# EasyEDA Pro project LisaFPGA Rev 2 EasyEDA Project.epro, schematic LisaFPGA Schematic, sheets 4 to 5 of 8

## Sheets
4 Floppy Interface: Create Date: 2025-10-27; Page Name: Floppy Interface; Update Date: 2026-01-15
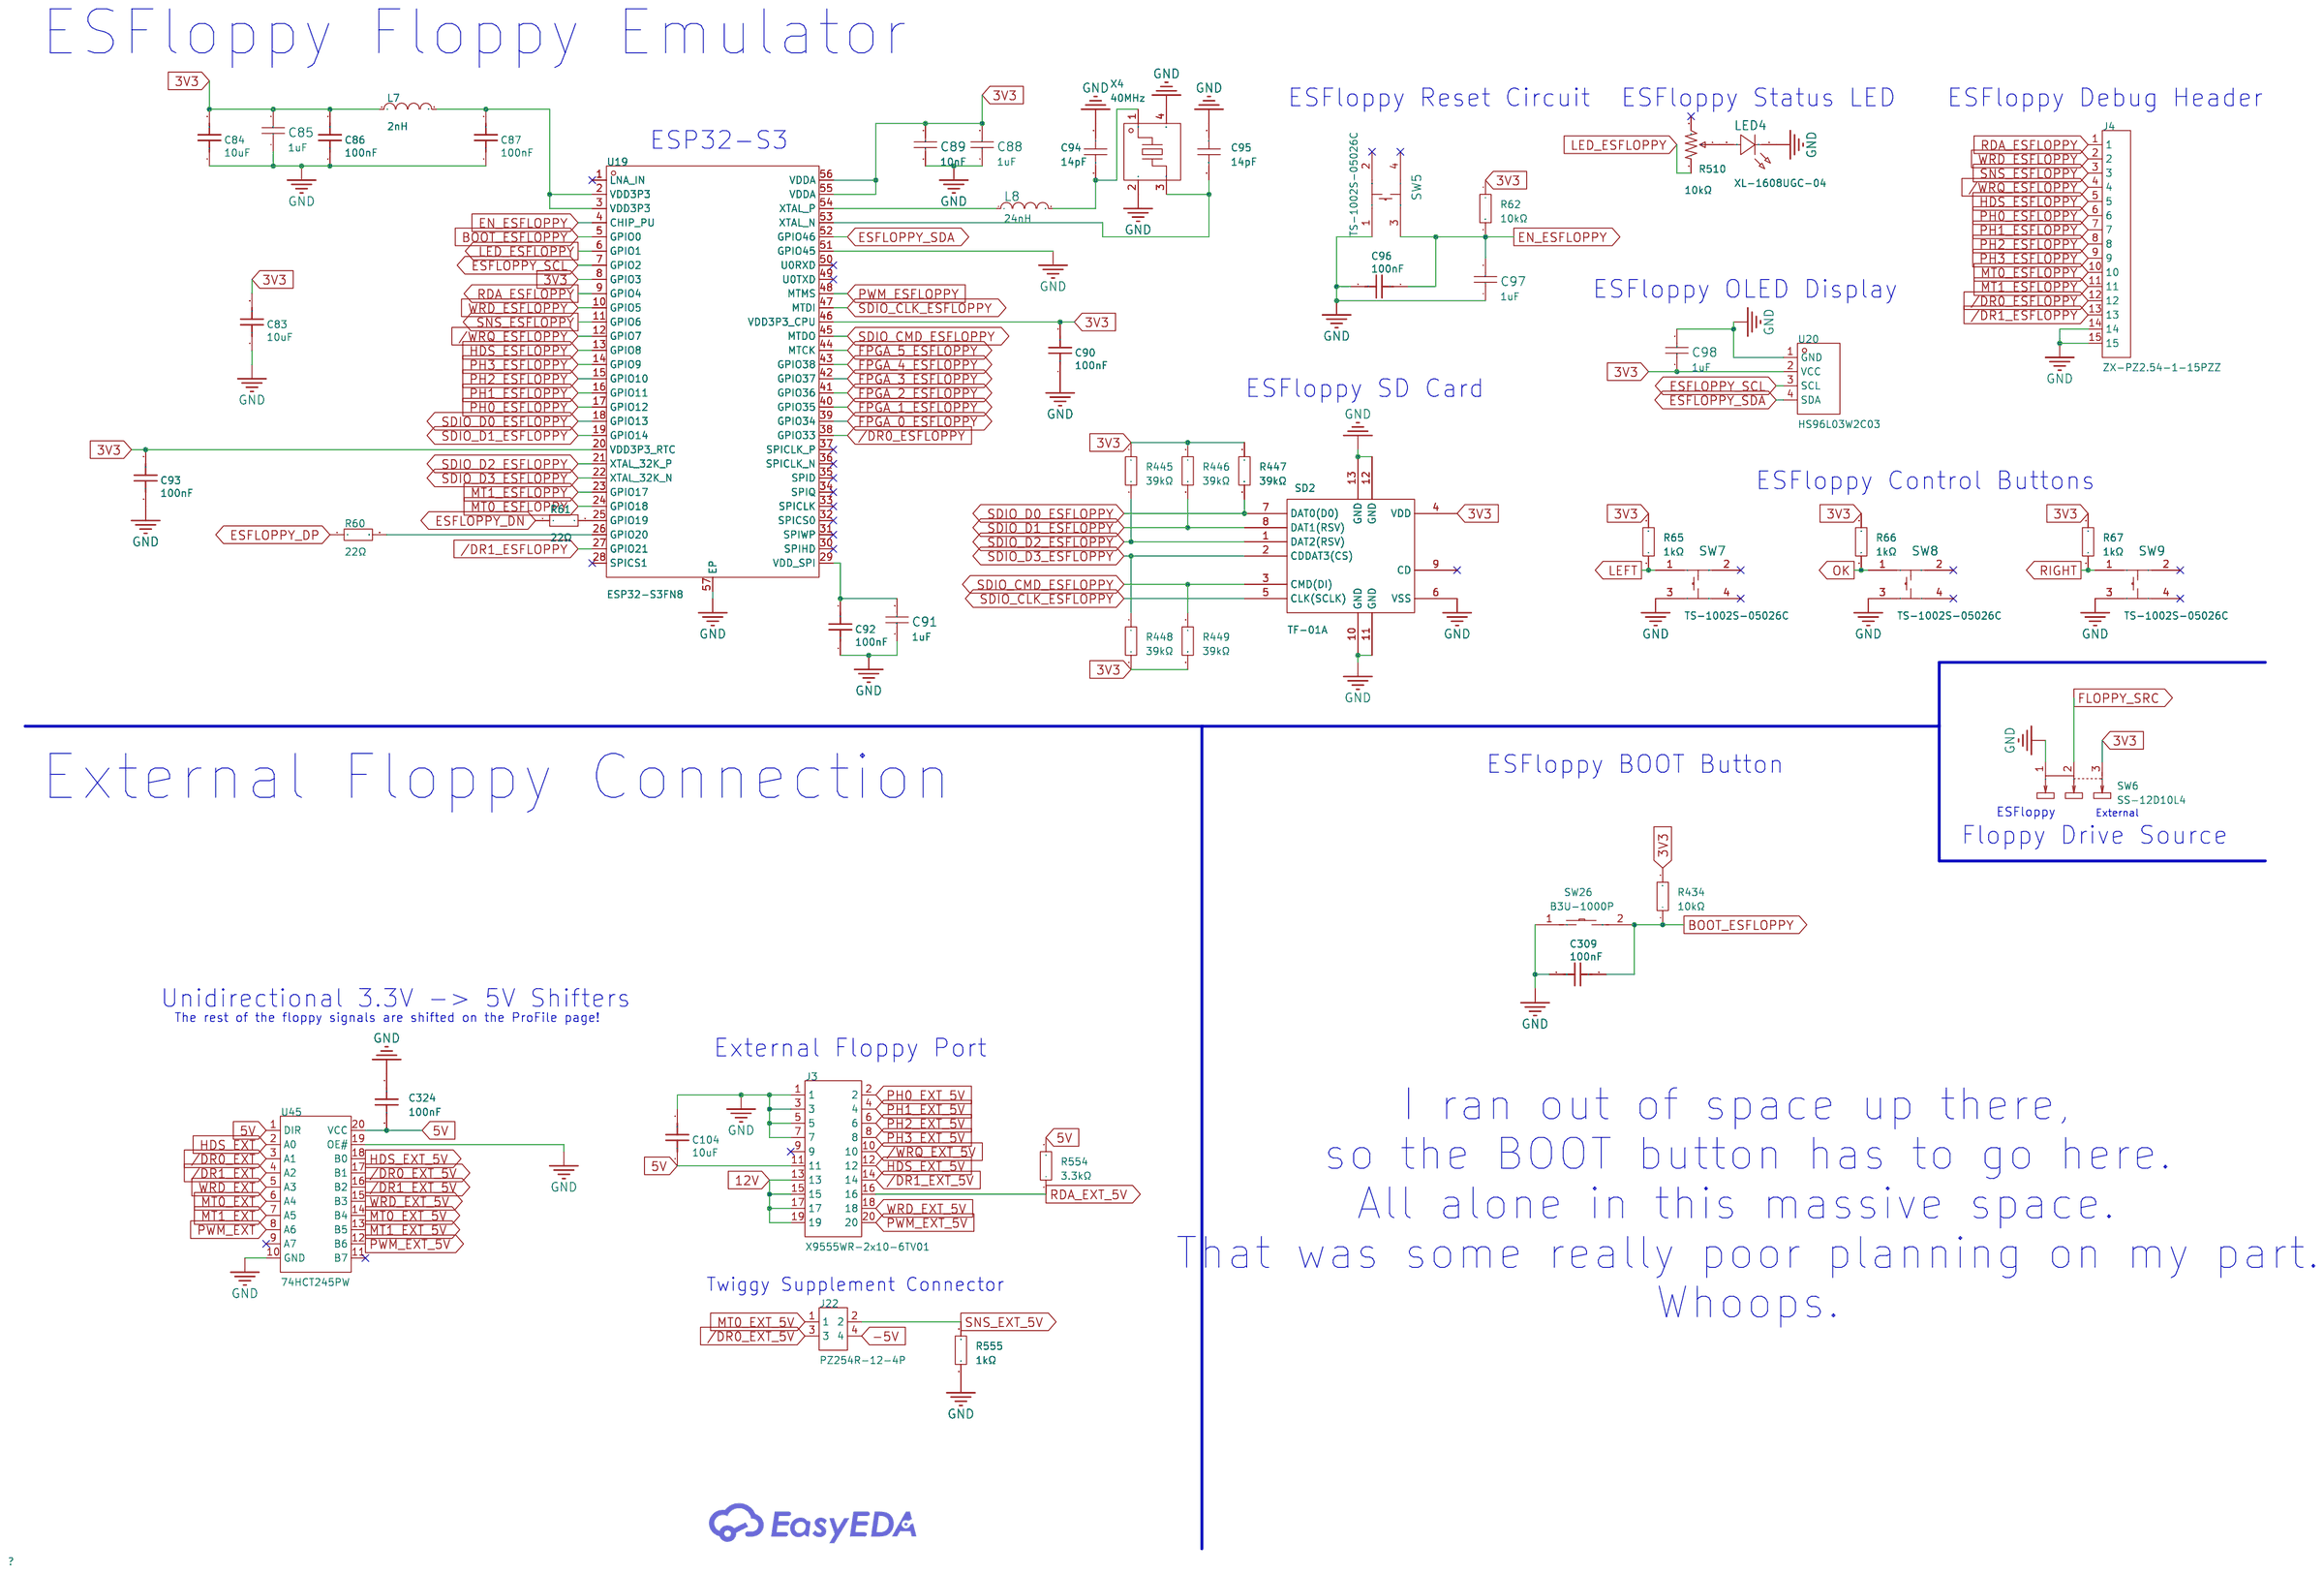
[diagram p4: Floppy Interface]
5 Serial Ports: Create Date: 2025-10-28; Page Name: Serial Ports; Update Date: 2026-01-13
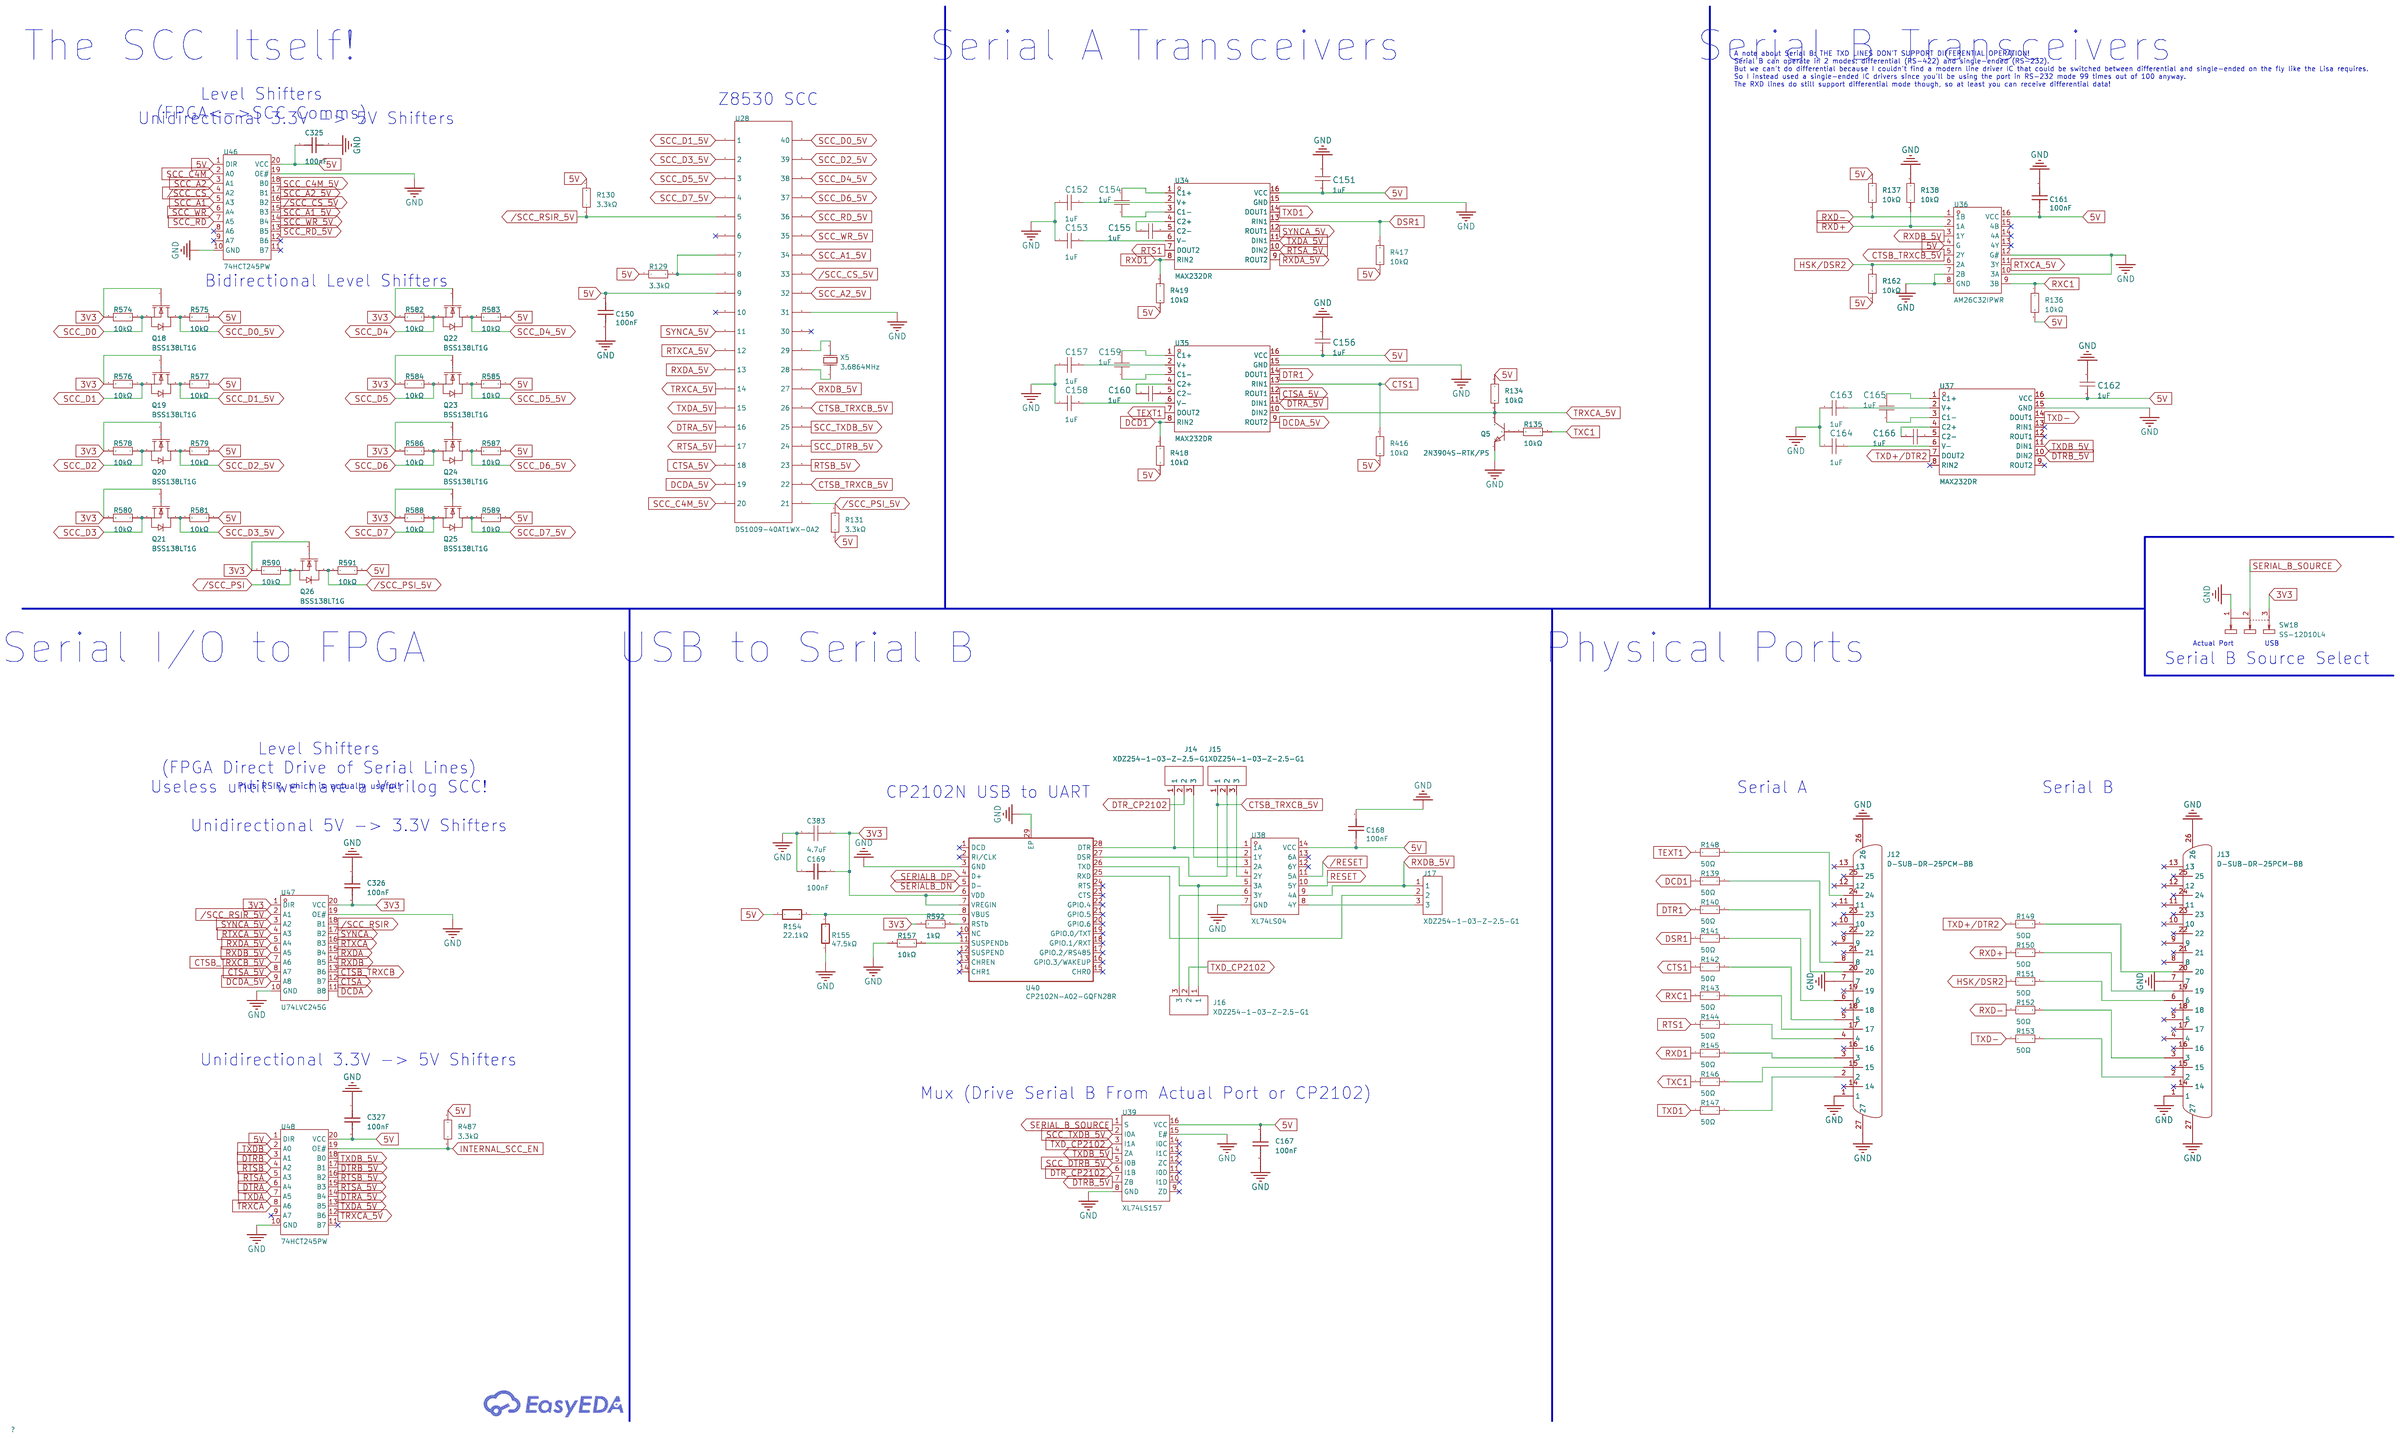
[diagram p5: Serial Ports]

## Parts
sheet Floppy Interface
C83  10uF  [C0603]
C84  10uF  [C0603]
C85  1uF  [C0402]
C86  100nF  [C0402]
C87  100nF  [C0402]
C88  1uF  [C0402]
C89  10nF  [C0402]
C90  100nF  [C0402]
C91  1uF  [C0402]
C92  100nF  [C0402]
C93  100nF  [C0402]
C94  14pF  [C0402]
C95  14pF  [C0402]
C96  100nF  [C0402]
C97  1uF  [C0402]
C98  1uF  [C0402]
C104  10uF  [C0603]
C309  100nF  [C0402]
C324  100nF  [C0402]
J3  X9555WR-2x10-6TV01  [CONN-TH_20P-P2.54_XKB_X9555WR-2X10-6TV01]
J4  ZX-PZ2.54-1-15PZZ  [HDR-TH_15P-P2.54-V-M]
J22  PZ254R-12-4P  [HDR-TH_4P-P2.54-H-M-R2-C2-S2.54]
L7  2nH  [L0402-RD]
L8  24nH  [IND-SMD_L1.6-W0.8]
LED4  XL-1608UGC-04  [LED0603-RD_GREEN]
R60  22Ω  [R0402]
R61  22Ω  [R0402]
R62  10kΩ  [R0402]
R65  1kΩ  [R0402]
R66  1kΩ  [R0402]
R67  1kΩ  [R0402]
R434  10kΩ  [R0402]
R445  39kΩ  [R0402]
R446  39kΩ  [R0402]
R447  39kΩ  [R0402]
R448  39kΩ  [R0402]
R449  39kΩ  [R0402]
R510  10kΩ  [RES-ADJ-SMD_3P-L3.0-W3.8-P1.75-BR]
R554  3.3kΩ  [R0402]
R555  1kΩ  [R0402]
SD2  TF-01A  [TF-SMD_TF-01A]
SW5  TS-1002S-05026C  [KEY-SMD_4P-L6.0-W6.0-P4.50-LS9.0]
SW6  SS-12D10L4  [SW-TH_SS-12D10L3]
SW7  TS-1002S-05026C  [KEY-SMD_4P-L6.0-W6.0-P4.50-LS9.0]
SW8  TS-1002S-05026C  [KEY-SMD_4P-L6.0-W6.0-P4.50-LS9.0]
SW9  TS-1002S-05026C  [KEY-SMD_4P-L6.0-W6.0-P4.50-LS9.0]
SW26  B3U-1000P  [KEY-SMD_B3U-1000PM]
U19  ESP32-S3FN8  [QFN-56_L7.0-W7.0-P0.40-TL-EP4.0]
U20  HS96L03W2C03  [OLED-TH_L27.8-W27.2-P2.54_C9900033791]
U45  74HCT245PW  [TSSOP-20_L6.5-W4.4-P0.65-LS6.4-BL]
X4  40MHz  [CRYSTAL-SMD_4P-L2.0-W1.6-BL-A]
sheet Serial Ports
C150  100nF  [C0402]
C151  1uF  [C0402]
C152  1uF  [C0402]
C153  1uF  [C0402]
C154  1uF  [C0402]
C155  1uF  [C0402]
C156  1uF  [C0402]
C157  1uF  [C0402]
C158  1uF  [C0402]
C159  1uF  [C0402]
C160  1uF  [C0402]
C161  100nF  [C0402]
C162  1uF  [C0402]
C163  1uF  [C0402]
C164  1uF  [C0402]
C165  1uF  [C0402]
C166  1uF  [C0402]
C167  100nF  [C0402]
C168  100nF  [C0402]
C169  100nF  [C0402]
C325  100nF  [C0402]
C326  100nF  [C0402]
C327  100nF  [C0402]
C383  4.7uF  [C0603]
J12  D-SUB-DR-25PCM-BB  [DB25-TH_D-SUB-DR-25PCM-BB]
J13  D-SUB-DR-25PCM-BB  [DB25-TH_D-SUB-DR-25PCM-BB]
J14  XDZ254-1-03-Z-2.5-G1  [HDR-TH_3P-P2.54-V-M-1]
J15  XDZ254-1-03-Z-2.5-G1  [HDR-TH_3P-P2.54-V-M-1]
J16  XDZ254-1-03-Z-2.5-G1  [HDR-TH_3P-P2.54-V-M-1]
J17  XDZ254-1-03-Z-2.5-G1  [HDR-TH_3P-P2.54-V-M-1]
Q5  2N3904S-RTK/PS  [SOT-23-3_L2.9-W1.3-P1.90-LS2.4-TR]
Q18  BSS138LT1G  [SOT-23-3_L2.9-W1.6-P1.90-LS2.8-BR]
Q19  BSS138LT1G  [SOT-23-3_L2.9-W1.6-P1.90-LS2.8-BR]
Q20  BSS138LT1G  [SOT-23-3_L2.9-W1.6-P1.90-LS2.8-BR]
Q21  BSS138LT1G  [SOT-23-3_L2.9-W1.6-P1.90-LS2.8-BR]
Q22  BSS138LT1G  [SOT-23-3_L2.9-W1.6-P1.90-LS2.8-BR]
Q23  BSS138LT1G  [SOT-23-3_L2.9-W1.6-P1.90-LS2.8-BR]
Q24  BSS138LT1G  [SOT-23-3_L2.9-W1.6-P1.90-LS2.8-BR]
Q25  BSS138LT1G  [SOT-23-3_L2.9-W1.6-P1.90-LS2.8-BR]
Q26  BSS138LT1G  [SOT-23-3_L2.9-W1.6-P1.90-LS2.8-BR]
R129  3.3kΩ  [R0402]
R130  3.3kΩ  [R0402]
R131  3.3kΩ  [R0402]
R134  10kΩ  [R0402]
R135  10kΩ  [R0402]
R136  10kΩ  [R0402]
R137  10kΩ  [R0402]
R138  10kΩ  [R0402]
R139  50Ω  [R0402]
R140  50Ω  [R0402]
R141  50Ω  [R0402]
R142  50Ω  [R0402]
R143  50Ω  [R0402]
R144  50Ω  [R0402]
R145  50Ω  [R0402]
R146  50Ω  [R0402]
R147  50Ω  [R0402]
R148  50Ω  [R0402]
R149  50Ω  [R0402]
R150  50Ω  [R0402]
R151  50Ω  [R0402]
R152  50Ω  [R0402]
R153  50Ω  [R0402]
R154  22.1kΩ  [R0603]
R155  47.5kΩ  [R0603]
R157  10kΩ  [R0402]
R162  10kΩ  [R0402]
R416  10kΩ  [R0402]
R417  10kΩ  [R0402]
R418  10kΩ  [R0402]
R419  10kΩ  [R0402]
R487  3.3kΩ  [R0402]
R574  10kΩ  [R0402]
R575  10kΩ  [R0402]
R576  10kΩ  [R0402]
R577  10kΩ  [R0402]
R578  10kΩ  [R0402]
R579  10kΩ  [R0402]
R580  10kΩ  [R0402]
R581  10kΩ  [R0402]
R582  10kΩ  [R0402]
R583  10kΩ  [R0402]
R584  10kΩ  [R0402]
R585  10kΩ  [R0402]
R586  10kΩ  [R0402]
R587  10kΩ  [R0402]
R588  10kΩ  [R0402]
R589  10kΩ  [R0402]
R590  10kΩ  [R0402]
R591  10kΩ  [R0402]
R592  1kΩ  [R0402]
SW18  SS-12D10L4  [SW-TH_SS-12D10L3]
U28  DS1009-40AT1WX-0A2  [DIP-40_L52.3-W13.9-P2.54-LS15.2-BL-BASE]
U34  MAX232DR  [SOIC-16_L9.9-W3.9-P1.27-LS6.0-BL]
U35  MAX232DR  [SOIC-16_L9.9-W3.9-P1.27-LS6.0-BL]
U36  AM26C32IPWR  [TSSOP-16_L5.0-W4.4-P0.65-LS6.4-BL]
U37  MAX232DR  [SOIC-16_L9.9-W3.9-P1.27-LS6.0-BL]
U38  XL74LS04  [SOP-14_L8.6-W3.9-P1.27-LS6.0-BL]
U39  XL74LS157  [SOP-16_L9.9-W3.9-P1.27-LS6.1-BL]
U40  CP2102N-A02-GQFN28R  [QFN-28_L5.0-W5.0-P0.50-TL-EP3.3]
U46  74HCT245PW  [TSSOP-20_L6.5-W4.4-P0.65-LS6.4-BL]
U47  U74LVC245G  [TSSOP-20_L6.5-W4.4-P0.65-LS6.4-BL]
U48  74HCT245PW  [TSSOP-20_L6.5-W4.4-P0.65-LS6.4-BL]
X5  3.6864MHz  [HC-49S_L11.4-W4.8-LS12.7]

## Library data of the parts
C83 C84 C104 = 10uF: Supplier: LCSC; Supplier Part: C2936601; Manufacturer: YAGEO(国巨); Manufacturer Part: CC0603KRX5R7BB106; JLCPCB Part Class: Extended Part; nameAlias: Value; Contributor: lcsc; spicePre: C; spiceSymbolName: CC0603KRX5R7BB106
C85 C88 C91 C97 C98 C151-C160 C162-C166 = CL05A105KO5NNNC: Capacitance:1uF Tolerance:±10% Tolerance:±10% Voltage Rating:16V Temperature Coefficient:X5R; LCSC Part Name: 1uF ±10% 16V; Supplier Part: C29266; Manufacturer: SAMSUNG(三星); Supplier Footprint: 0402; JLCPCB Part Class: Extended Part; Datasheet: https://item.szlcsc.com/datasheet/CL05A105KO5NNNC/30018.html; Supplier: LCSC; Tolerance: ±10%; Voltage Rating: 16V; Temperature Coefficient: X5R
C86 C87 C90 C92 C93 C96 C150 C161 C167-C169 C309 C324-C327 = 100nF: Supplier: LCSC; Supplier Part: C343042; Manufacturer: TDK; Manufacturer Part: CGA2B3X7R1H104KT0Y0F; JLCPCB Part Class: Extended Part; nameAlias: Value; Contributor: LCSC; spicePre: C; spiceSymbolName: CGA2B3X7R1H104KT0Y0F
C89 = CC0402KRX7R9BB103: Capacitance:10nF Tolerance:±10% Tolerance:±10% Voltage Rating:50V Temperature Coefficient:X7R; LCSC Part Name: 10nF ±10% 50V; Supplier Part: C60133; Manufacturer: YAGEO(国巨); Supplier Footprint: 0402; JLCPCB Part Class: Extended Part; Datasheet: https://item.szlcsc.com/datasheet/CC0402KRX7R9BB103/61185.html; Supplier: LCSC; Tolerance: ±10%; Voltage Rating: 50V; Temperature Coefficient: X7R
C94 C95 = 0402N140J500CT: Capacitance:14pF Tolerance:±5% Tolerance:±5% Voltage Rating:50V Temperature Coefficient:NP0; LCSC Part Name: 14pF ±5% 50V; Supplier Part: C458857; Manufacturer: Walsin(华新科); Supplier Footprint: 0402; JLCPCB Part Class: Extended Part; Datasheet: https://item.szlcsc.com/datasheet/0402N140J500CT/462940.html; Supplier: LCSC; Tolerance: ±5%; Voltage Rating: 50V; Temperature Coefficient: NP0
J3 = X9555WR-2x10-6TV01: Pins Structure:2x10P Pitch:2.54mm Mounting Style:Right-Angle Reference Series:- Number of Pins:20P Number of Rows:2 Number of PINs Per Row:10 Row Spacing:2.54mm Current Rating (Max):3A Contact Material:Brass Contact Plating:Tin Operating Temperature Range; LCSC Part Name: 2x10P 间距:2.54mm 弯插; Supplier Part: C2884508; Manufacturer: XKB Connection(中国星坤); Supplier Footprint: 弯插,P=2.54mm; JLCPCB Part Class: Extended Part; Datasheet: https://atta.szlcsc.com/upload/public/pdf/source/20211009/ED69AC5D0B165AFEE3838F4DF324EF6E.pdf; Supplier: LCSC; Pins Structure: 2x10P; Pitch: 2.54mm; Mounting Style: Right-Angle; Number of Pins: 20P; Number of Rows: 2; Number of PINs Per Row: 10; Row Spacing: 2.54mm; Current Rating (Max): 3A; Contact Material: Brass; Contact Plating: Tin
J4 = ZX-PZ2.54-1-15PZZ: Pin Structure:1x15P Pitch:2.54mm Row Spacing:- Circluar Pins/Square Pins:Pin Header Mounting Type:Through Hole Number of Rows:1 Number of Pins:15P Current Rating:3A Voltage Rating (Max):- Length of Mating Pin:6mm Insulation Height:2.5mm Length of End Conn; LCSC Part Name: 1x15P 间距:2.54mm 方针 直插; Supplier Part: C7501269; Manufacturer: Megastar(兆星); Supplier Footprint: 插件,P=2.54mm; JLCPCB Part Class: Extended Part; Datasheet: https://item.szlcsc.com/datasheet/ZX-PZ2.54-1-15PZZ/8582482.html; Supplier: LCSC; Pin Structure: 1x15P; Pitch: 2.54mm; Circluar Pins/Square Pins: Pin Header; Mounting Type: Through Hole; Number of Rows: 1; Number of Pins: 15P; Current Rating: 3A; Length of Mating Pin: 6mm; Insulation Height: 2.5mm; Length of End Connection Pin: 3mm; Contact Material: Brass; Contact Plating: Gold; Operating Temperature: -40℃~+105℃; Color: Black
J22 = PZ254R-12-4P: Pin Structure:2x2P Pitch:2.54mm Row Spacing:2.54mm Circluar Pins/Square Pins:Policy Mounting Type:Right-Angle Number of Rows:Double Row Number of Pins:4P Current Rating:- Voltage Rating (Max):- Length of Mating Pin:6mm Insulation Height:2.5mm Contact Mate; LCSC Part Name: 2x2P 间距:2.54mm 方针 弯插; Supplier Part: C492430; Manufacturer: XFCN(兴飞); Supplier Footprint: 弯插,P=2.54mm; JLCPCB Part Class: Extended Part; Datasheet: https://atta.szlcsc.com/upload/public/pdf/source/20200309/C492430_40F61060098E2A512B5822C8CF53ABE1.pdf; Supplier: LCSC; Pin Structure: 2x2P; Pitch: 2.54mm; Row Spacing: 2.54mm; Circluar Pins/Square Pins: Policy; Mounting Type: Right-Angle; Number of Rows: Double Row; Number of Pins: 4P; Length of Mating Pin: 6mm; Insulation Height: 2.5mm; Contact Material: Brass; Operating Temperature: -40℃~+105℃; Color: Black
L7 = MLG1005S2N0ST000: Inductance: Tolerance:- Tolerance:- Current Rating: Current - Saturation (Isat):- DC Resistance(DCR): Q @ Frequency:7@100MHz Frequency - Self Resonant: Ratings:; LCSC Part Name: ±0.3nH 2nH; Supplier Part: C98757; Manufacturer: TDK; Supplier Footprint: 0402; JLCPCB Part Class: Extended Part; Datasheet: https://atta.szlcsc.com/upload/public/pdf/source/20180928/C275290_71FD5C0A90A4E94260814ECBF3BC6ADD.pdf; Supplier: LCSC; Q @ Frequency: 7@100MHz
L8 = LQW18AN24NG00D: Inductance:24nH Tolerance:±2% Tolerance:±2% Current Rating:500mA Current - Saturation(Isat):- DC Resistance(DCR):210mΩ Ratings:-; LCSC Part Name: 24nH ±2%; Supplier Part: C162644; Manufacturer: muRata(村田); Supplier Footprint: 0603; JLCPCB Part Class: Extended Part; Datasheet: https://item.szlcsc.com/datasheet/LQW18AN24NG00D/174025.html; Supplier: LCSC; Tolerance: ±2%; Current Rating: 500mA; DC Resistance(DCR): 210mΩ
LED4 = XL-1608UGC-04: Lamp Holder Type:- Illumination Color:Emerald Green Voltage - Forward(Vf):3.3V Voltage - Forward(Vf):3.3V Power(Watts):70mW Forward Current:20mA Wavelength - Dominant:515nm~535nm Wavelength - Dominant:515nm~535nm Peak Wavelength:525nm Diode Configuration:; Supplier Part: C965804; Manufacturer: XINGLIGHT(成兴光); Supplier Footprint: 0603; JLCPCB Part Class: Extended Part; Datasheet: https://item.szlcsc.com/datasheet/XL-1608UGC-04/1051413.html; Supplier: LCSC; Illumination Color: Emerald Green; Voltage - Forward(Vf): 3.3V; Power(Watts): 70mW; Forward Current: 20mA; Wavelength - Dominant: 515nm~535nm; Peak Wavelength: 525nm; Diode Configuration: Discrete Diode; Lens Color: Water Clear; Luminous Intensity: 810mcd; Viewing Angle: 120°; Mounting Style: op View Mount
R60 R61 = RC0402FR-0722RL: Type:Thick Film Resistors Resistance: Tolerance:±1% Tolerance:±1% Power(Watts): Overload Voltage (Max): Temperature Coefficient:±100ppm/℃ Temperature Coefficient:±100ppm/℃ Operating Temperature Range:-55℃~+155℃ Operating Temperature Range:-55℃~+155℃; LCSC Part Name: 厚膜电阻 22Ω ±1% 62.5mW; Supplier Part: C114765; Manufacturer: YAGEO(国巨); Supplier Footprint: 0402; JLCPCB Part Class: Extended Part; Datasheet: https://atta.szlcsc.com/upload/public/pdf/source/20180821/C275644_0D56F95EFF785E7D9A1FEF436B37DA78.pdf; Supplier: LCSC; Type: Thick Film Resistors; Tolerance: ±1%; Temperature Coefficient: ±100ppm/℃; Operating Temperature Range: -55℃~+155℃
R62 R134-R138 R157 R162 R416-R419 R434 R574-R591 = RC0402FR-0710KL: Type:Thick Film Resistor Resistance:10kΩ Tolerance:±1% Tolerance:±1% Power(Watts):62.5mW Voltage-Supply(Max):50V Temperature Coefficient:±100ppm/℃ Temperature Coefficient:±100ppm/℃ Operating Temperature:-55℃~+155℃ Operating Temperature:-55℃~+155℃; LCSC Part Name: 厚膜电阻 10kΩ ±1% 62.5mW; Supplier Part: C60490; Manufacturer: YAGEO(国巨); Supplier Footprint: 0402; JLCPCB Part Class: Extended Part; Datasheet: https://item.szlcsc.com/datasheet/RC0402FR-0710KL/61542.html; Supplier: LCSC; Type: Thick Film Resistor; Tolerance: ±1%; Power(Watts): 62.5mW; Voltage-Supply(Max): 50V; Temperature Coefficient: ±100ppm/℃; Operating Temperature: -55℃~+155℃
R65-R67 R555 R592 = RC0402FR-071KL: Type:Thick Film Resistors Resistance: Tolerance:±1% Tolerance:±1% Power(Watts): Overload Voltage (Max): Temperature Coefficient:±100ppm/℃ Temperature Coefficient:±100ppm/℃ Operating Temperature Range:-55℃~+155℃ Operating Temperature Range:-55℃~+155℃; LCSC Part Name: 厚膜电阻 1kΩ ±1% 62.5mW; Supplier Part: C106235; Manufacturer: YAGEO(国巨); Supplier Footprint: 0402; JLCPCB Part Class: Extended Part; Datasheet: https://atta.szlcsc.com/upload/public/pdf/source/20180927/C295883_E8D83085EA81BD7DE0B2B681138C15EE.pdf; Supplier: LCSC; Type: Thick Film Resistors; Tolerance: ±1%; Temperature Coefficient: ±100ppm/℃; Operating Temperature Range: -55℃~+155℃
R445-R449 = 0402WGF3902TCE: Type:Thick Film Resistor Resistance:39kΩ Tolerance:±1% Tolerance:±1% Power(Watts):62.5mW Voltage-Supply(Max):50V Temperature Coefficient:±100ppm/℃ Temperature Coefficient:±100ppm/℃ Operating Temperature:-55℃~+155℃ Operating Temperature:-55℃~+155℃; LCSC Part Name: 39kΩ ±1% 62.5mW 厚膜电阻; Supplier Part: C25783; Manufacturer: UNI-ROYAL(厚声); Supplier Footprint: 0402; JLCPCB Part Class: Extended Part; Datasheet: https://item.szlcsc.com/datasheet/0402WGF3902TCE/26526.html; Supplier: LCSC; Type: Thick Film Resistor; Tolerance: ±1%; Power(Watts): 62.5mW; Voltage-Supply(Max): 50V; Temperature Coefficient: ±100ppm/℃; Operating Temperature: -55℃~+155℃
R510 = TC33X-2-103E: Resistance:10kΩ Tolerance:±25% Tolerance:±25% Voltage Rating:- Power(Watts):150mW Temperature Coefficient:±250ppm/℃ Temperature Coefficient:±250ppm/℃ Number of Turns:; LCSC Part Name: 10kΩ ±25%; Supplier Part: C719176; Manufacturer: BOURNS; Supplier Footprint: SMD-3P,3.8x3.6mm; JLCPCB Part Class: Extended Part; Datasheet: https://item.szlcsc.com/datasheet/TC33X-2-103E/762158.html; Supplier: LCSC; Tolerance: ±25%; Power(Watts): 150mW; Temperature Coefficient: ±250ppm/℃
R129-R131 R487 R554 = RC0402FR-073K3L: Type:Thick Film Resistor Resistance:3.3kΩ Tolerance:±1% Tolerance:±1% Power(Watts):62.5mW Voltage-Supply(Max):50V Temperature Coefficient:±100ppm/℃ Temperature Coefficient:±100ppm/℃ Operating Temperature:-55℃~+155℃ Operating Temperature:-55℃~+155℃; LCSC Part Name: 厚膜电阻 3.3kΩ ±1% 62.5mW; Supplier Part: C137992; Manufacturer: YAGEO(国巨); Supplier Footprint: 0402; JLCPCB Part Class: Extended Part; Datasheet: https://item.szlcsc.com/datasheet/RC0402FR-073K3L/149308.html; Supplier: LCSC; Type: Thick Film Resistor; Tolerance: ±1%; Power(Watts): 62.5mW; Voltage-Supply(Max): 50V; Temperature Coefficient: ±100ppm/℃; Operating Temperature: -55℃~+155℃
SD2 = TF-01A_C91145: Card Connection Mode:Push-Push Card Type:MicroSD Card (TF Card) Connector Type:Connector and Ejector Additional Card Detection Pins:- Supplementary Features:With Locating Post Height Above Board:1.85mm Operating Temperature:- Operating Temperature:-; LCSC Part Name: 自弹式 MicroSD卡(TF卡) 卡座; Supplier Part: C91145; Manufacturer: 韩国韩荣; Supplier Footprint: SMD; JLCPCB Part Class: Extended Part; Datasheet: https://item.szlcsc.com/datasheet/TF-01A/92334.html; Supplier: LCSC; Card Connection Mode: Push-Push; Card Type: MicroSD Card (TF Card); Connector Type: Connector and Ejector; Supplementary Features: With Locating Post; Height Above Board: 1.85mm
SW5 SW7-SW9 = TS-1002S-05026C: Circuit:SPST Actuator Style:Round Button Mounting Type:Surface Mount,Vertical Length:6mm Width:6mm Switch Height:5mm Contact Current:50mA Voltage Rating:12V With Lamp:- Life:-; LCSC Part Name: 6*6*5mm 立贴 轻触开关; Supplier Part: C455110; Manufacturer: XUNPU(讯普); Supplier Footprint: SMD-4P,6x6mm; JLCPCB Part Class: Extended Part; Datasheet: https://item.szlcsc.com/datasheet/TS-1002S-05026C/457515.html; Supplier: LCSC; Circuit: SPST; Actuator Style: Round Button; Mounting Type: Surface Mount,Vertical; Length: 6mm; Width: 6mm; Switch Height: 5mm; Contact Current: 50mA; Voltage Rating: 12V
SW6 SW18 = SS-12D10L4: Circuit:SPDT Actuator Style:Rectangular Columnar Termination Style:PC Pin Length:13mm Width:6.8mm Switch Height:6.4mm Mounting Type:Through Hole Actuator Color:Black Current Rating:3A Voltage Rating:125V Life:10,000 Cycles Operating Temperature:-40℃~+85℃; LCSC Part Name: 柄长4mm 直插双档 滑动开关; Supplier Part: C843364; Manufacturer: XKB Connection(中国星坤); Supplier Footprint: 插件,13x6.8mm; JLCPCB Part Class: Extended Part; Datasheet: https://item.szlcsc.com/datasheet/SS-12D10L4/902366.html; Supplier: LCSC; Circuit: SPDT; Actuator Style: Rectangular Columnar; Termination Style: PC Pin; Length: 13mm; Width: 6.8mm; Switch Height: 6.4mm; Mounting Type: Through Hole; Actuator Color: Black; Current Rating: 3A; Voltage Rating: 125V; Life: 10,000 Cycles; Operating Temperature: -40℃~+85℃
SW26 = B3U-1000P_C231329: Circuit:SPST Actuator Style:Round Button Operating Force:1.53N Mounting Type:Surface Mount,Vertical Length:3mm Width:2.5mm Switch Height:1.6mm Contact Current:50mA Voltage Rating:12V With Lamp:- Termination Style:SMD(SMT) Tab Life:- Operating Temperature:; LCSC Part Name: 3*2.5*1.6mm 立贴 轻触开关; Supplier Part: C231329; Manufacturer: OMRON(欧姆龙); Supplier Footprint: SMD,2.5x3mm; JLCPCB Part Class: Extended Part; Datasheet: https://item.szlcsc.com/datasheet/B3U-1000P/231216.html; Supplier: LCSC; Circuit: SPST; Actuator Style: Round Button; Operating Force: 1.53N; Mounting Type: Surface Mount,Vertical; Length: 3mm; Width: 2.5mm; Switch Height: 1.6mm; Contact Current: 50mA; Voltage Rating: 12V; Termination Style: SMD(SMT) Tab; Operating Temperature: -25℃~+70℃
U19 = ESP32-S3FN8: Supplier Part: C2913196; Manufacturer: ESPRESSIF(乐鑫); Supplier Footprint: QFN-56-EP(7x7); JLCPCB Part Class: Extended Part; Datasheet: https://item.szlcsc.com/datasheet/ESP32-S3FN8/3198294.html; Supplier: LCSC
U20 = HS96L03W2C03: Main Control Chip:SSD1315 Interface Type:I2C Size:0.96 Pixel Resolution:128x64 Operating Temperature:-40℃~+70℃ Operating Temperature:-40℃~+70℃; LCSC Part Name: 0.96寸OLED显示屏窄白光IIC; Supplier Part: C5248080; Manufacturer: HS(汉昇); JLCPCB Part Class: Extended Part; Datasheet: https://atta.szlcsc.com/upload/public/pdf/source/20230627/763D01F79A90007632F098068C7C8AD9.pdf; Supplier: LCSC; Main Control Chip: SSD1315; Interface Type: I2C; Size: 0.96; Pixel Resolution: 128x64; Operating Temperature: -40℃~+70℃
U45 U46 U48 = 74HCT245PW: Supplier Part: C52140501; Manufacturer: MDD(辰达半导体); Supplier Footprint: TSSOP-20L; JLCPCB Part Class: Extended Part; Datasheet: https://item.szlcsc.com/datasheet/74HCT245PW/54938180.html; Supplier: LCSC
X4 = XTM20040000FT00351001: Type:Crystal Oscillator Frequency:40MHz Normal temperature Frequency Tolerance:±10ppm Normal temperature Frequency Tolerance:±10ppm Load Capacitance:9pF Frequency Stability:±10ppm Frequency Stability:±10ppm Equivalent Series Resistance(ESR):40Ω Operating; LCSC Part Name: 40MHz 4P 2016 9pF ±10ppm -20~70℃（±10ppm）; Supplier Part: C37635335; Manufacturer: 同晶; Supplier Footprint: SMD2016-4P; JLCPCB Part Class: Extended Part; Datasheet: https://item.szlcsc.com/datasheet/XTM20040000FT00351001/39361267.html; Supplier: LCSC; Type: Crystal Oscillator; Normal temperature Frequency Tolerance: ±10ppm; Load Capacitance: 9pF; Frequency Stability: ±10ppm; Equivalent Series Resistance(ESR): 40Ω; Operating Temperature: -20℃~+70℃
C383 = CL10A475KO8NNNC: Capacitance:4.7uF Tolerance:±10% Tolerance:±10% Voltage Rating:16V Temperature Coefficient:X5R; LCSC Part Name: 4.7uF ±10% 16V; Supplier Part: C19666; Manufacturer: SAMSUNG(三星); Supplier Footprint: 0603; JLCPCB Part Class: Basic Part; Datasheet: https://item.szlcsc.com/datasheet/CL10A475KO8NNNC/20375.html; Supplier: LCSC; Tolerance: ±10%; Voltage Rating: 16V; Temperature Coefficient: X5R
J12 J13 = D-SUB-DR-25PCM-BB: Gender:Female Number of Pins:25P Mounting Type:Right Angle Number of Rows:2 Current Rating-Signal:3A Color:Black Operating Temperature:-50℃~+105℃ Operating Temperature:-50℃~+105℃; LCSC Part Name: 母 P数:25P; Supplier Part: C19077339; Manufacturer: XUNPU(讯普); Supplier Footprint: 弯插; JLCPCB Part Class: Extended Part; Datasheet: https://item.szlcsc.com/datasheet/D-SUB-DR-25PCM-BB/20275083.html; Supplier: LCSC; Gender: Female; Number of Pins: 25P; Mounting Type: Right Angle; Number of Rows: 2; Current Rating-Signal: 3A; Color: Black; Operating Temperature: -50℃~+105℃
J14-J17 = XDZ254-1-03-Z-2.5-G1: Pin Structure:1x3P Pitch:2.54mm Circluar Pins/Square Pins:Pin Header Mounting Type:Through Hole Number of Rows:1 Number of Pins:3P Current Rating:3A Length of Mating Pin:6mm Insulation Height:2.5mm Length of End Connection Pin:3mm Operating Temperature:-4; LCSC Part Name: 1x3P 间距:2.54mm 方针 直插; Supplier Part: C18905844; Manufacturer: XUNDA(讯答); Supplier Footprint: 插件,P=2.54mm; JLCPCB Part Class: Extended Part; Datasheet: https://item.szlcsc.com/datasheet/XDZ254-1-03-Z-2.5-G1/20100548.html; Supplier: LCSC; Pin Structure: 1x3P; Pitch: 2.54mm; Circluar Pins/Square Pins: Pin Header; Mounting Type: Through Hole; Number of Rows: 1; Number of Pins: 3P; Current Rating: 3A; Length of Mating Pin: 6mm; Insulation Height: 2.5mm; Length of End Connection Pin: 3mm; Operating Temperature: -40℃~+105℃; Color: Black
Q5 = 2N3904S-RTK/PS_C18536: type:NPN Current - Collector(Ic):200mA Collector - Emitter Voltage VCEO:40V Pd - Power Dissipation:350mW DC Current Gain:100@10mA,1V DC Current Gain:100@10mA,1V Transition frequency(fT):300MHz Current - Collector Cutoff:- Vce Saturation(VCE(sat)):300mV Op; LCSC Part Name: NPN 电流:200mA 电压:40V; Supplier Part: C18536; Manufacturer: KEC; Supplier Footprint: SOT-23; JLCPCB Part Class: Extended Part; Datasheet: https://item.szlcsc.com/datasheet/2N3904S-RTK%252FPS/19236.html; Supplier: LCSC; type: NPN; Current - Collector(Ic): 200mA; Collector - Emitter Voltage VCEO: 40V; Pd - Power Dissipation: 350mW; DC Current Gain: 100@10mA,1V; Transition frequency(fT): 300MHz; Vce Saturation(VCE(sat)): 300mV
Q18-Q26 = BSS138LT1G: Number:1 N-Channel Drain to Source Voltage:50V Current - Continuous Drain(Id):200mA RDS(on):5.6Ω@2.75V Pd - Power Dissipation:225mW Gate Threshold Voltage (Vgs(th)):500mV Input Capacitance(Ciss):50pF@25V Reverse Transfer Capacitance (Crss@Vds):5pF@25V Ope; LCSC Part Name: 1个N沟道 耐压:50V 电流:200mA; Supplier Part: C82045; Manufacturer: onsemi(安森美); Supplier Footprint: SOT-23; JLCPCB Part Class: Extended Part; Datasheet: https://item.szlcsc.com/datasheet/BSS138LT1G/83200.html; Supplier: LCSC; Number: 1 N-Channel; Drain to Source Voltage: 50V; Current - Continuous Drain(Id): 200mA; RDS(on): 5.6Ω@2.75V; Pd - Power Dissipation: 225mW; Gate Threshold Voltage (Vgs(th)): 500mV; Input Capacitance(Ciss): 50pF@25V; Reverse Transfer Capacitance (Crss@Vds): 5pF@25V; Operating Temperature: -55℃~+150℃
R139-R153 = RT0402BRE0750RL: Type:Thin Film Resistor Resistance: Tolerance:±0.1% Tolerance:±0.1% Power(Watts): Temperature Coefficient:±50ppm/℃ Temperature Coefficient:±50ppm/℃ Operating Temperature Range:-55℃~+155℃ Operating Temperature Range:-55℃~+155℃; LCSC Part Name: 薄膜电阻 50Ω ±0.1% 62.5mW; Supplier Part: C853312; Manufacturer: YAGEO(国巨); Supplier Footprint: 0402; JLCPCB Part Class: Extended Part; Datasheet: https://atta.szlcsc.com/upload/public/pdf/source/20200610/C326738_5639A9F1B6EB6E4AE2197577D3456E7F.pdf; Supplier: LCSC; Type: Thin Film Resistor; Tolerance: ±0.1%; Temperature Coefficient: ±50ppm/℃; Operating Temperature Range: -55℃~+155℃
R154 = 22.1kΩ: Supplier: LCSC; Supplier Part: C7470229; Manufacturer: RESI(开步睿思); Manufacturer Part: PTFR0603B22K1N9; JLCPCB Part Class: Extended Part; nameAlias: Value; Contributor: lcsc; spicePre: R; spiceSymbolName: PTFR0603B22K1N9
R155 = 47.5kΩ: Supplier: LCSC; Supplier Part: C319611; Manufacturer: Viking(光颉); Manufacturer Part: AR03BTCX4752; JLCPCB Part Class: Extended Part; nameAlias: Value; Contributor: LCSC; spicePre: R; spiceSymbolName: AR03BTCX4752
U28 = DS1009-40AT1WX-0A2: Adaptation Package Type:DIP Pitch:2.54mm Row Spacing:15.24mm Number of Positions:40P Contact Plating:Tin; LCSC Part Name: 间距2.54mm P数:40P; Supplier Part: C72123; Manufacturer: CONNFLY; Supplier Footprint: DIP-40; JLCPCB Part Class: Extended Part; Datasheet: https://item.szlcsc.com/datasheet/DS1009-40AT1WX-0A2/73232.html; Supplier: LCSC; Adaptation Package Type: DIP; Pitch: 2.54mm; Row Spacing: 15.24mm; Number of Positions: 40P; Contact Plating: Tin
U34 U35 U37 = MAX232DR: Type:transceiver Number of Drivers:2 Number of Receivers:2 Data Rate:120Kbps Data Rate:120Kbps Voltage - Supply:4.5V~5.5V Voltage - Supply:4.5V~5.5V Operating Temperature:0℃~+70℃ Operating Temperature:0℃~+70℃; LCSC Part Name: MAX232双EIA-232驱动器/接收器; Supplier Part: C158068; Manufacturer: TI(德州仪器); Supplier Footprint: SOIC-16; JLCPCB Part Class: Extended Part; Datasheet: https://www.ti.com/cn/lit/gpn/max232; Supplier: LCSC; Type: transceiver; Number of Drivers: 2; Number of Receivers: 2; Data Rate: 120Kbps; Voltage - Supply: 4.5V~5.5V; Operating Temperature: 0℃~+70℃
U36 = AM26C32IPWR: Type:Receivers Number of Drivers:0 Number of Receivers:4 Voltage - Supply:4.5V~5.5V Voltage - Supply:4.5V~5.5V Operating Temperature:-40℃~+85℃ Operating Temperature:-40℃~+85℃; LCSC Part Name: AM26C32 四路差分线接收器; Supplier Part: C478459; Manufacturer: TI(德州仪器); Supplier Footprint: TSSOP-16; JLCPCB Part Class: Extended Part; Datasheet: https://www.ti.com/cn/lit/gpn/am26c32; Supplier: LCSC; Type: Receivers; Number of Drivers: 0; Number of Receivers: 4; Voltage - Supply: 4.5V~5.5V; Operating Temperature: -40℃~+85℃
U38 = XL74LS04: LCSC Part Name: 变换器; Supplier Part: C513511; Manufacturer: XINLUDA(信路达); Supplier Footprint: SOP-14; JLCPCB Part Class: Extended Part; Datasheet: https://atta.szlcsc.com/upload/public/pdf/source/20240521/0AB49CF7E88DFA0D2356C93769A6E588.pdf; Supplier: LCSC
U39 = XL74LS157: LCSC Part Name: 编码器,解码器,复用器和解复用器; Supplier Part: C707097; Manufacturer: XINLUDA(信路达); Supplier Footprint: SOP-16; JLCPCB Part Class: Extended Part; Datasheet: https://atta.szlcsc.com/upload/public/pdf/source/20240911/F40F2946A66FB32919DA0EFC6B4B1E0A.pdf; Supplier: LCSC
U40 = CP2102N-A02-GQFN28R: Supplier: LCSC; Supplier Part: C964632; Manufacturer: SKYWORKS/SILICON LABS(芯科); JLCPCB Part Class: Extended Part; Contributor: LCSC; spicePre: U
U47 = U74LVC245G: Supplier Part: C7494910; Manufacturer: UTC(友顺); Supplier Footprint: TSSOP-20; JLCPCB Part Class: Extended Part; Datasheet: https://item.szlcsc.com/datasheet/U74LVC245G/8557814.html; Supplier: LCSC
X5 = H6OEL89CSC-SUGYLC-3.6864M: Type:Crystal Oscillator Frequency:3.6864MHz Normal temperature Frequency Tolerance:±20ppm Normal temperature Frequency Tolerance:±20ppm Load Capacitance:20pF Frequency Stability:±30ppm Frequency Stability:±30ppm Operating Temperature:-20℃~+70℃ Operating T; LCSC Part Name: HC-49SMD 3.6864MHZ 2P 49SMD 20PF ±20PPM -20~70℃（±30PPM）; Supplier Part: C19078185; Manufacturer: YXC(扬兴晶振); Supplier Footprint: HC-49S-SMD; JLCPCB Part Class: Extended Part; Datasheet: https://item.szlcsc.com/datasheet/H6OEL89CSC-SUGYLC-3.6864M/20279962.html; Supplier: LCSC; Type: Crystal Oscillator; Normal temperature Frequency Tolerance: ±20ppm; Load Capacitance: 20pF; Frequency Stability: ±30ppm; Operating Temperature: -20℃~+70℃

## Nets
3V3: C83.2 C84.2 C85.2 C86.2 C88.2 C89.2 C90.2 C93.2 C98.1 C169.2 C326.2 C383.1 L7.1 Q18.1(G) Q19.1(G) Q20.1(G) Q21.1(G) Q22.1(G) Q23.1(G) Q24.1(G) Q25.1(G) Q26.1(G) R62.1 R65.2 R66.2 R67.2 R434.2 R445.1 R446.1 R447.1 R448.2 R449.2 R574.2 R576.2 R578.2 R580.2 R582.2 R584.2 R586.2 R588.2 R590.2 R592.1 SD2.4(VDD) SW6.3 SW18.3 U19.8(GPIO3) U19.20(VDD3P3_RTC) U19.46(VDD3P3_CPU) U19.55(VDDA) U19.56(VDDA) U20.2(VCC) U40.6(VDD) U40.7(VREGIN) U47.1(DIR) U47.20(VCC) ; also on sheet 1 2 3 6 7 8
5V: C104.1 C150.2 C151.1 C156.1 C161.1 C162.1 C167.1 C168.1 C324.2 C325.1 C327.2 J3.11 R129.1 R130.2 R131.2 R134.1 R136.2 R137.1 R154.1 R162.2 R416.2 R417.2 R418.2 R419.2 R487.1 R554.2 R575.1 R577.1 R579.1 R581.1 R583.1 R585.1 R587.1 R589.1 R591.1 U28.9 U34.16(VCC) U35.16(VCC) U36.4(G) U36.16(VCC) U37.16(VCC) U38.14(VCC) U39.16(VCC) U45.1(DIR) U45.20(VCC) U46.1(DIR) U46.20(VCC) U48.1(DIR) U48.20(VCC) ; also on sheet 1 2 3 6 7
12V: J3.13 J3.15 J3.17 J3.19 ; also on sheet 1 6
-5V: J22.4 ; also on sheet 1
GND: C83.1 C84.1 C85.1 C86.1 C87.1 C88.1 C89.1 C90.1 C91.1 C92.1 C93.1 C94.1 C95.1 C96.2 C97.1 C98.2 C104.2 C150.1 C151.2 C152.2 C153.1 C156.2 C157.2 C158.1 C161.2 C162.2 C163.2 C164.1 C167.2 C168.2 C169.1 C309.2 C324.1 C325.2 C326.1 C327.1 C383.2 J3.1 J3.3 J3.5 J3.7 J4.14 J4.15 J12.1 J12.7 J12.26 J12.27 J13.1 J13.7 J13.26 J13.27 LED4.1(K) Q5.1(E) R138.1 R155.1 R157.1 R555.1 SD2.6(VSS) SD2.10(GND) SD2.11(GND) SD2.12(GND) SD2.13(GND) SW5.1 SW6.1 SW7.3 SW8.3 SW9.3 SW18.1 SW26.1 U19.51(GPIO45) U19.57(EP) U20.1(GND) U28.31 U34.15(GND) U35.15(GND) U36.7(2B) U36.8(GND) U36.10(3A) U36.12(G#) U37.15(GND) U38.7(GND) U39.8(GND) U39.15(E#) U40.3(GND) U40.29(EP) U45.10(GND) U45.19(OE#) U46.10(GND) U46.19(OE#) U47.10(GND) U47.19(OE#) U48.10(GND) X4.2(GND) X4.4(GND) ; also on sheet 1 2 3 6 7 8
/DR0_ESFLOPPY: J4.12 U19.38(GPIO33) ; also on sheet 8
/DR0_EXT: U45.3(A1) ; also on sheet 8
/DR0_EXT_5V: J22.3 U45.17(B1)
/DR1_ESFLOPPY: J4.13 U19.27(GPIO21) ; also on sheet 8
/DR1_EXT: U45.4(A2) ; also on sheet 8
/DR1_EXT_5V: J3.14 U45.16(B2)
/RESET: U38.11(5A) ; also on sheet 8
/SCC_CS: U46.4(A2) ; also on sheet 8
/SCC_CS_5V: U28.33 U46.16(B2)
/SCC_PSI: Q26.2(S) R590.1 ; also on sheet 8
/SCC_PSI_5V: Q26.3(D) R131.1 R591.2 U28.21
/SCC_RSIR: U47.18(B1) ; also on sheet 8
/SCC_RSIR_5V: R130.1 U28.5 U47.2(A1)
/WRQ_ESFLOPPY: J4.4 U19.12(GPIO7) ; also on sheet 8
/WRQ_EXT_5V: J3.10 ; also on sheet 3
BOOT_ESFLOPPY: C309.1 R434.1 SW26.2 U19.5(GPIO0)
CTS1: R142.1 R416.1 U35.13(RIN1)
CTSA: U47.12(B7) ; also on sheet 8
CTSA_5V: U28.18 U35.12(ROUT1) U47.8(A7)
CTSB_TRXCB: U47.13(B6) ; also on sheet 8
CTSB_TRXCB_5V: J15.1 U28.22 U28.26 U36.5(2Y) U38.3(2A) U47.7(A6)
DCD1: R139.1 R418.1 U35.8(RIN2)
DCDA: U47.11(B8) ; also on sheet 8
DCDA_5V: U28.19 U35.9(ROUT2) U47.9(A8)
DSR1: R141.1 R417.1 U34.13(RIN1)
DTR1: R140.1 U35.14(DOUT1)
DTR_CP2102: J14.2 U39.6(I1B)
DTRA: U48.6(A4) ; also on sheet 8
DTRA_5V: U28.16 U35.11(DIN1) U48.14(B4)
DTRB: U48.3(A1) ; also on sheet 8
DTRB_5V: U37.10(DIN2) U39.7(ZB) U48.17(B1)
EN_ESFLOPPY: C96.1 C97.2 R62.2 SW5.3 U19.4(CHIP_PU)
ESFLOPPY_DN: R61.1 ; also on sheet 1
ESFLOPPY_DP: R60.1 ; also on sheet 1
ESFLOPPY_SCL: U19.7(GPIO2) U20.3(SCL)
ESFLOPPY_SDA: U19.52(GPIO46) U20.4(SDA)
FLOPPY_SRC: SW6.2 ; also on sheet 8
FPGA_0_ESFLOPPY: U19.39(GPIO34) ; also on sheet 8
FPGA_1_ESFLOPPY: U19.40(GPIO35) ; also on sheet 8
FPGA_2_ESFLOPPY: U19.41(GPIO36) ; also on sheet 8
FPGA_3_ESFLOPPY: U19.42(GPIO37) ; also on sheet 8
FPGA_4_ESFLOPPY: U19.43(GPIO38) ; also on sheet 8
FPGA_5_ESFLOPPY: U19.44(MTCK) ; also on sheet 8
HDS_ESFLOPPY: J4.5 U19.13(GPIO8) ; also on sheet 8
HDS_EXT: U45.2(A0) ; also on sheet 8
HDS_EXT_5V: J3.12 U45.18(B0)
HSK/DSR2: R151.1 R162.1 U36.6(2A)
INTERNAL_SCC_EN: R487.2 U48.19(OE#) ; also on sheet 8
LED_ESFLOPPY: R510.1 U19.6(GPIO1)
LEFT: R65.1 SW7.1 ; also on sheet 8
MT0_ESFLOPPY: J4.10 U19.24(GPIO18) ; also on sheet 8
MT0_EXT: U45.6(A4) ; also on sheet 8
MT0_EXT_5V: J22.1 U45.14(B4)
MT1_ESFLOPPY: J4.11 U19.23(GPIO17) ; also on sheet 8
MT1_EXT: U45.7(A5) ; also on sheet 8
MT1_EXT_5V: U45.13(B5)
OK: R66.1 SW8.1 ; also on sheet 8
PH0_ESFLOPPY: J4.6 U19.17(GPIO12) ; also on sheet 8
PH0_EXT_5V: J3.2 ; also on sheet 3
PH1_ESFLOPPY: J4.7 U19.16(GPIO11) ; also on sheet 8
PH1_EXT_5V: J3.4 ; also on sheet 3
PH2_ESFLOPPY: J4.8 U19.15(GPIO10) ; also on sheet 8
PH2_EXT_5V: J3.6 ; also on sheet 3
PH3_ESFLOPPY: J4.9 U19.14(GPIO9) ; also on sheet 8
PH3_EXT_5V: J3.8 ; also on sheet 3
PWM_ESFLOPPY: U19.48(MTMS) ; also on sheet 8
PWM_EXT: U45.8(A6) ; also on sheet 8
PWM_EXT_5V: J3.20 U45.12(B6)
RDA_ESFLOPPY: J4.1 U19.9(GPIO4) ; also on sheet 8
RDA_EXT_5V: J3.16 R554.1 ; also on sheet 3
RESET: U38.10(5Y)
RIGHT: R67.1 SW9.1 ; also on sheet 8
RTS1: R144.1 U34.7(DOUT2)
RTSA: U48.5(A3) ; also on sheet 8
RTSA_5V: U28.17 U34.10(DIN2) U48.15(B3)
RTSB: U48.4(A2) ; also on sheet 8
RTSB_5V: U28.23 U48.16(B2)
RTXCA: U47.16(B3) ; also on sheet 8
RTXCA_5V: U28.12 U36.11(3Y) U47.4(A3)
RXC1: R136.1 R143.1 U36.9(3B)
RXD1: R145.1 R419.1 U34.8(RIN2)
RXD+: R138.2 R150.1 U36.2(1A)
RXD-: R137.2 R152.1 U36.1(1B)
RXDA: U47.15(B4) ; also on sheet 8
RXDA_5V: U28.13 U34.9(ROUT2) U47.5(A4)
RXDB: U47.14(B5) ; also on sheet 8
RXDB_5V: J17.1 U28.27 U36.3(1Y) U38.9(4A) U47.6(A5)
SCC_A1: U46.5(A3) ; also on sheet 8
SCC_A1_5V: U28.34 U46.15(B3)
SCC_A2: U46.3(A1) ; also on sheet 8
SCC_A2_5V: U28.32 U46.17(B1)
SCC_C4M: U46.2(A0) ; also on sheet 8
SCC_C4M_5V: U28.20 U46.18(B0)
SCC_D0: Q18.2(S) R574.1 ; also on sheet 8
SCC_D0_5V: Q18.3(D) R575.2 U28.40
SCC_D1: Q19.2(S) R576.1 ; also on sheet 8
SCC_D1_5V: Q19.3(D) R577.2 U28.1
SCC_D2: Q20.2(S) R578.1 ; also on sheet 8
SCC_D2_5V: Q20.3(D) R579.2 U28.39
SCC_D3: Q21.2(S) R580.1 ; also on sheet 8
SCC_D3_5V: Q21.3(D) R581.2 U28.2
SCC_D4: Q22.2(S) R582.1 ; also on sheet 8
SCC_D4_5V: Q22.3(D) R583.2 U28.38
SCC_D5: Q23.2(S) R584.1 ; also on sheet 8
SCC_D5_5V: Q23.3(D) R585.2 U28.3
SCC_D6: Q24.2(S) R586.1 ; also on sheet 8
SCC_D6_5V: Q24.3(D) R587.2 U28.37
SCC_D7: Q25.2(S) R588.1 ; also on sheet 8
SCC_D7_5V: Q25.3(D) R589.2 U28.4
SCC_DTRB_5V: U28.24 U39.5(I0B)
SCC_RD: U46.7(A5) ; also on sheet 8
SCC_RD_5V: U28.36 U46.13(B5)
SCC_TXDB_5V: U28.25 U39.2(I0A)
SCC_WR: U46.6(A4) ; also on sheet 8
SCC_WR_5V: U28.35 U46.14(B4)
SDIO_CLK_ESFLOPPY: SD2.5(CLK(SCLK)) U19.47(MTDI)
SDIO_CMD_ESFLOPPY: R449.1 SD2.3(CMD(DI)) U19.45(MTDO)
SDIO_D0_ESFLOPPY: R447.2 SD2.7(DAT0(D0)) U19.18(GPIO13)
SDIO_D1_ESFLOPPY: R446.2 SD2.8(DAT1(RSV)) U19.19(GPIO14)
SDIO_D2_ESFLOPPY: R445.2 SD2.1(DAT2(RSV)) U19.21(XTAL_32K_P)
SDIO_D3_ESFLOPPY: R448.1 SD2.2(CDDAT3(CS)) U19.22(XTAL_32K_N)
SERIAL_B_SOURCE: SW18.2 U39.1(S)
SERIALB_DN: U40.5(D-) ; also on sheet 1
SERIALB_DP: U40.4(D+) ; also on sheet 1
SNS_ESFLOPPY: J4.3 U19.11(GPIO6) ; also on sheet 8
SNS_EXT_5V: J22.2 R555.2 ; also on sheet 3
SYNCA: U47.17(B2) ; also on sheet 8
SYNCA_5V: U28.11 U34.12(ROUT1) U47.3(A2)
TEXT1: R148.1 U35.7(DOUT2)
TRXCA: U48.8(A6) ; also on sheet 8
TRXCA_5V: Q5.3(C) R134.2 U28.14 U35.10(DIN2) U48.12(B6)
TXC1: R135.2 R146.1
TXD1: R147.1 U34.14(DOUT1)
TXD+/DTR2: R149.1 U37.7(DOUT2)
TXD-: R153.1 U37.14(DOUT1)
TXD_CP2102: J16.2 U39.3(I1A)
TXDA: U48.7(A5) ; also on sheet 8
TXDA_5V: U28.15 U34.11(DIN1) U48.13(B5)
TXDB: U48.2(A0) ; also on sheet 8
TXDB_5V: U37.11(DIN1) U39.4(ZA) U48.18(B0)
WRD_ESFLOPPY: J4.2 U19.10(GPIO5) ; also on sheet 8
WRD_EXT: U45.5(A3) ; also on sheet 8
WRD_EXT_5V: J3.18 U45.15(B3)
$4N41299: C91.2 C92.2 U19.29(VDD_SPI)
$4N41306: R60.2 U19.26(GPIO20)
$4N41307: R61.2 U19.25(GPIO19)
$4N41310: C87.2 L7.2 U19.2(VDD3P3) U19.3(VDD3P3)
$4N41314: C95.2 U19.53(XTAL_N) X4.3
$4N41317: L8.1 U19.54(XTAL_P)
$4N41318: C94.2 L8.2 X4.1
$4N49594: LED4.2(A) R510.2
$5N23366: J17.2 U40.25(RXD)
$5N23367: J16.1 U38.5(3A) U40.26(TXD)
$5N23368: J16.3 U38.6(3Y)
$5N23369: J15.2 U40.27(DSR)
$5N23370: J15.3 U38.4(2Y)
$5N23373: J14.3 U38.2(1Y)
$5N23374: J14.1 U38.1(1A) U40.28(DTR)
$5N23394: R157.2 U40.11(SUSPENDb)
$5N23396: J17.3 U38.8(4Y)
$5N23403: R154.2 R155.2 U40.8(VBUS)
$5N23434: C166.1 U37.4(C2+)
$5N23435: C163.1 U37.2(V+)
$5N23436: C165.2 U37.3(C1-)
$5N23437: C166.2 U37.5(C2-)
$5N23438: C165.1 U37.1(C1+)
$5N23439: C164.2 U37.6(V-)
$5N26035: R129.2 U28.7 U28.8
$5N26056: U28.29 X5.2(OSC2)
$5N26057: U28.28 X5.1(OSC1)
$5N26117: C152.1 U34.2(V+)
$5N26118: C153.2 U34.6(V-)
$5N26120: C154.1 U34.1(C1+)
$5N26121: C154.2 U34.3(C1-)
$5N26122: C155.2 U34.5(C2-)
$5N26123: C155.1 U34.4(C2+)
$5N26127: C157.1 U35.2(V+)
$5N26128: C158.2 U35.6(V-)
$5N26130: C159.1 U35.1(C1+)
$5N26131: C159.2 U35.3(C1-)
$5N26132: C160.2 U35.5(C2-)
$5N26133: C160.1 U35.4(C2+)
$5N27320: J12.20 R140.2
$5N27321: J12.8 R139.2
$5N27322: J12.24 R148.2
$5N27333: J12.6 R141.2
$5N27334: J12.5 R142.2
$5N27335: J12.17 R143.2
$5N27336: J12.2 R147.2
$5N27337: J12.15 R146.2
$5N27338: J12.3 R145.2
$5N27339: J12.4 R144.2
$5N27343: J13.6 R151.2
$5N27344: J13.19 R150.2
$5N27345: J13.20 R149.2
$5N27347: J13.3 R152.2
$5N27348: J13.2 R153.2
$5N33275: Q5.2(B) R135.1
$5N41570: R592.2 U40.9(RSTb)

Not connected (* = marked no-connect by the designer): J3 9*; J12 9* 10* 11* 12* 13* 14* 16* 18* 19* 21* 22* 23* 25*; J13 4* 5* 8* 9* 10* 11* 12* 13* 14* 15* 16* 17* 18* 21* 22* 23* 24* 25*; R510 3*; SD2 9(CD)*; SW5 2* 4*; SW7 2* 4*; SW8 2* 4*; SW9 2* 4*; U19 1(LNA_IN)* 28(SPICS1)* 30(SPIHD)* 31(SPIWP)* 32(SPICS0)* 33(SPICLK)* 34(SPIQ)* 35(SPID)* 36(SPICLK_N)* 37(SPICLK_P)* 49(U0TXD)* 50(U0RXD)*; U28 6* 10* 30*; U36 13(4Y)* 14(4A)* 15(4B)*; U37 8(RIN2)* 9(ROUT2)* 12(ROUT1)* 13(RIN1)*; U38 12(6Y)* 13(6A)*; U39 9(ZD)* 10(I1D)* 11(I0D)* 12(ZC)* 13(I1C)* 14(I0C)*; U40 1(DCD)* 2(RI/CLK)* 10(NC)* 12(SUSPEND)* 13(CHREN)* 14(CHR1)* 15(CHR0)* 16(GPIO.3/WAKEUP)* 17(GPIO.2/RS485)* 18(GPIO.1/RXT)* 19(GPIO.0/TXT)* 20(GPIO.6)* 21(GPIO.5)* 22(GPIO.4)* 23(CTS)* 24(RTS)*; U45 9(A7)* 11(B7)*; U46 8(A6)* 9(A7)* 11(B7)* 12(B6)*; U48 9(A7)* 11(B7)*

## Notes on the sheets
sheet 4
- ESFloppy Floppy Emulator
- ESFloppy Reset Circuit
- ESFloppy Status LED
- ESFloppy Debug Header
- ESP32-S3
- ESFloppy OLED Display
- ESFloppy SD Card
- ESFloppy Control Buttons
- ESFloppy BOOT Button
- External Floppy Connection
- ESFloppy
- External
- Floppy Drive Source
- Unidirectional 3.3V -> 5V Shifters
- The rest of the floppy signals are shifted on the ProFile page!
- External Floppy Port
- I ran out of space up there,
  so the BOOT button has to go here.
  All alone in this massive space.
  That was some really poor planning on my part.
  Whoops.
- Twiggy Supplement Connector
sheet 5
- The SCC Itself!
- Serial A Transceivers
- Serial B Transceivers
- Level Shifters
  (FPGA<->SCC Comms)
- A note about Serial B: THE TXD LINES DON'T SUPPORT DIFFERENTIAL OPERATION!
  Serial B can operate in 2 modes: differential (RS-422) and single-ended (RS-232).
  But we can't do differential because I couldn't find a modern line driver IC that could be switched between differential and single-ended on the fly like the Lisa requires.
  So I instead used a single-ended IC drivers since you'll be using the port in RS-232 mode 99 times out of 100 anyway.
  The RXD lines do still support differential mode though, so at least you can receive differential data!
- Z8530 SCC
- Unidirectional 3.3V -> 5V Shifters
- Bidirectional Level Shifters
- Actual Port
- USB
- Serial I/O to FPGA
- USB to Serial B
- Physical Ports
- Serial B Source Select
- Level Shifters
  (FPGA Direct Drive of Serial Lines)
  Useless until we have a Verilog SCC!
- Plus RSIR, which is actually useful!
- CP2102N USB to UART
- Serial A
- Serial B
- Unidirectional 5V -> 3.3V Shifters
- Unidirectional 3.3V -> 5V Shifters
- Mux (Drive Serial B From Actual Port or CP2102)
